# EAGLE design light (EAGLE 8.5.0)
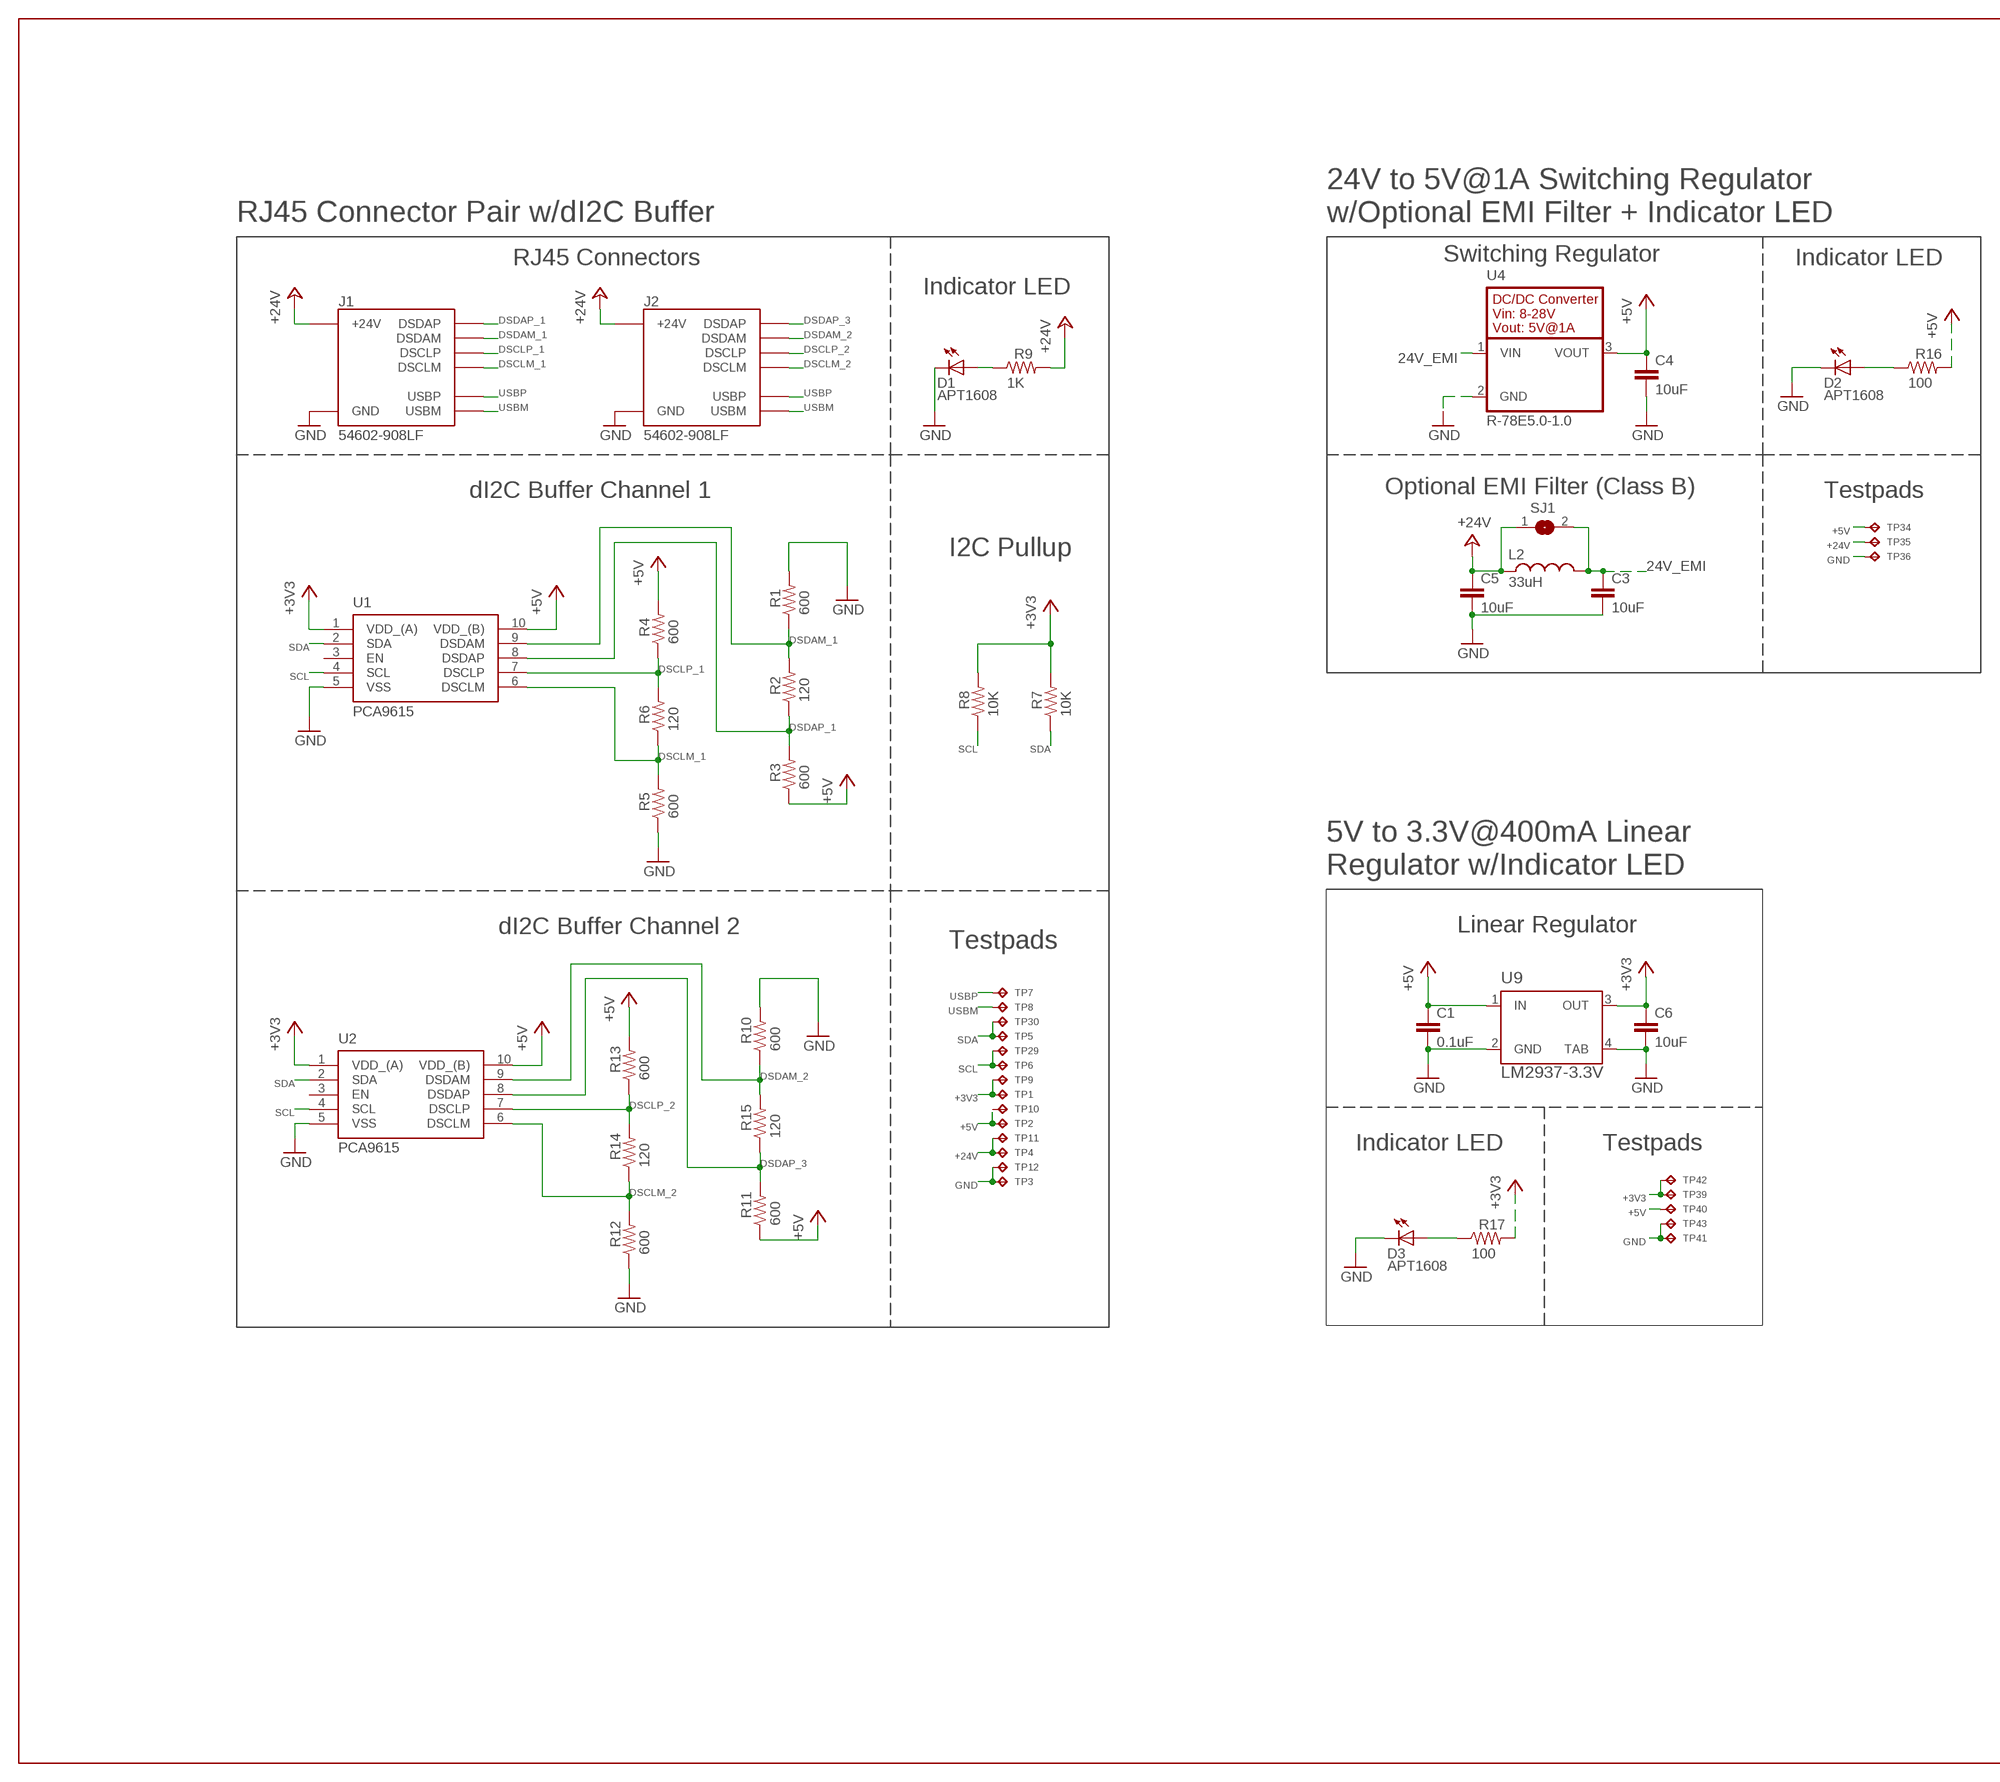
[diagram p0: schematic, sheet 1, part 1 of 2]
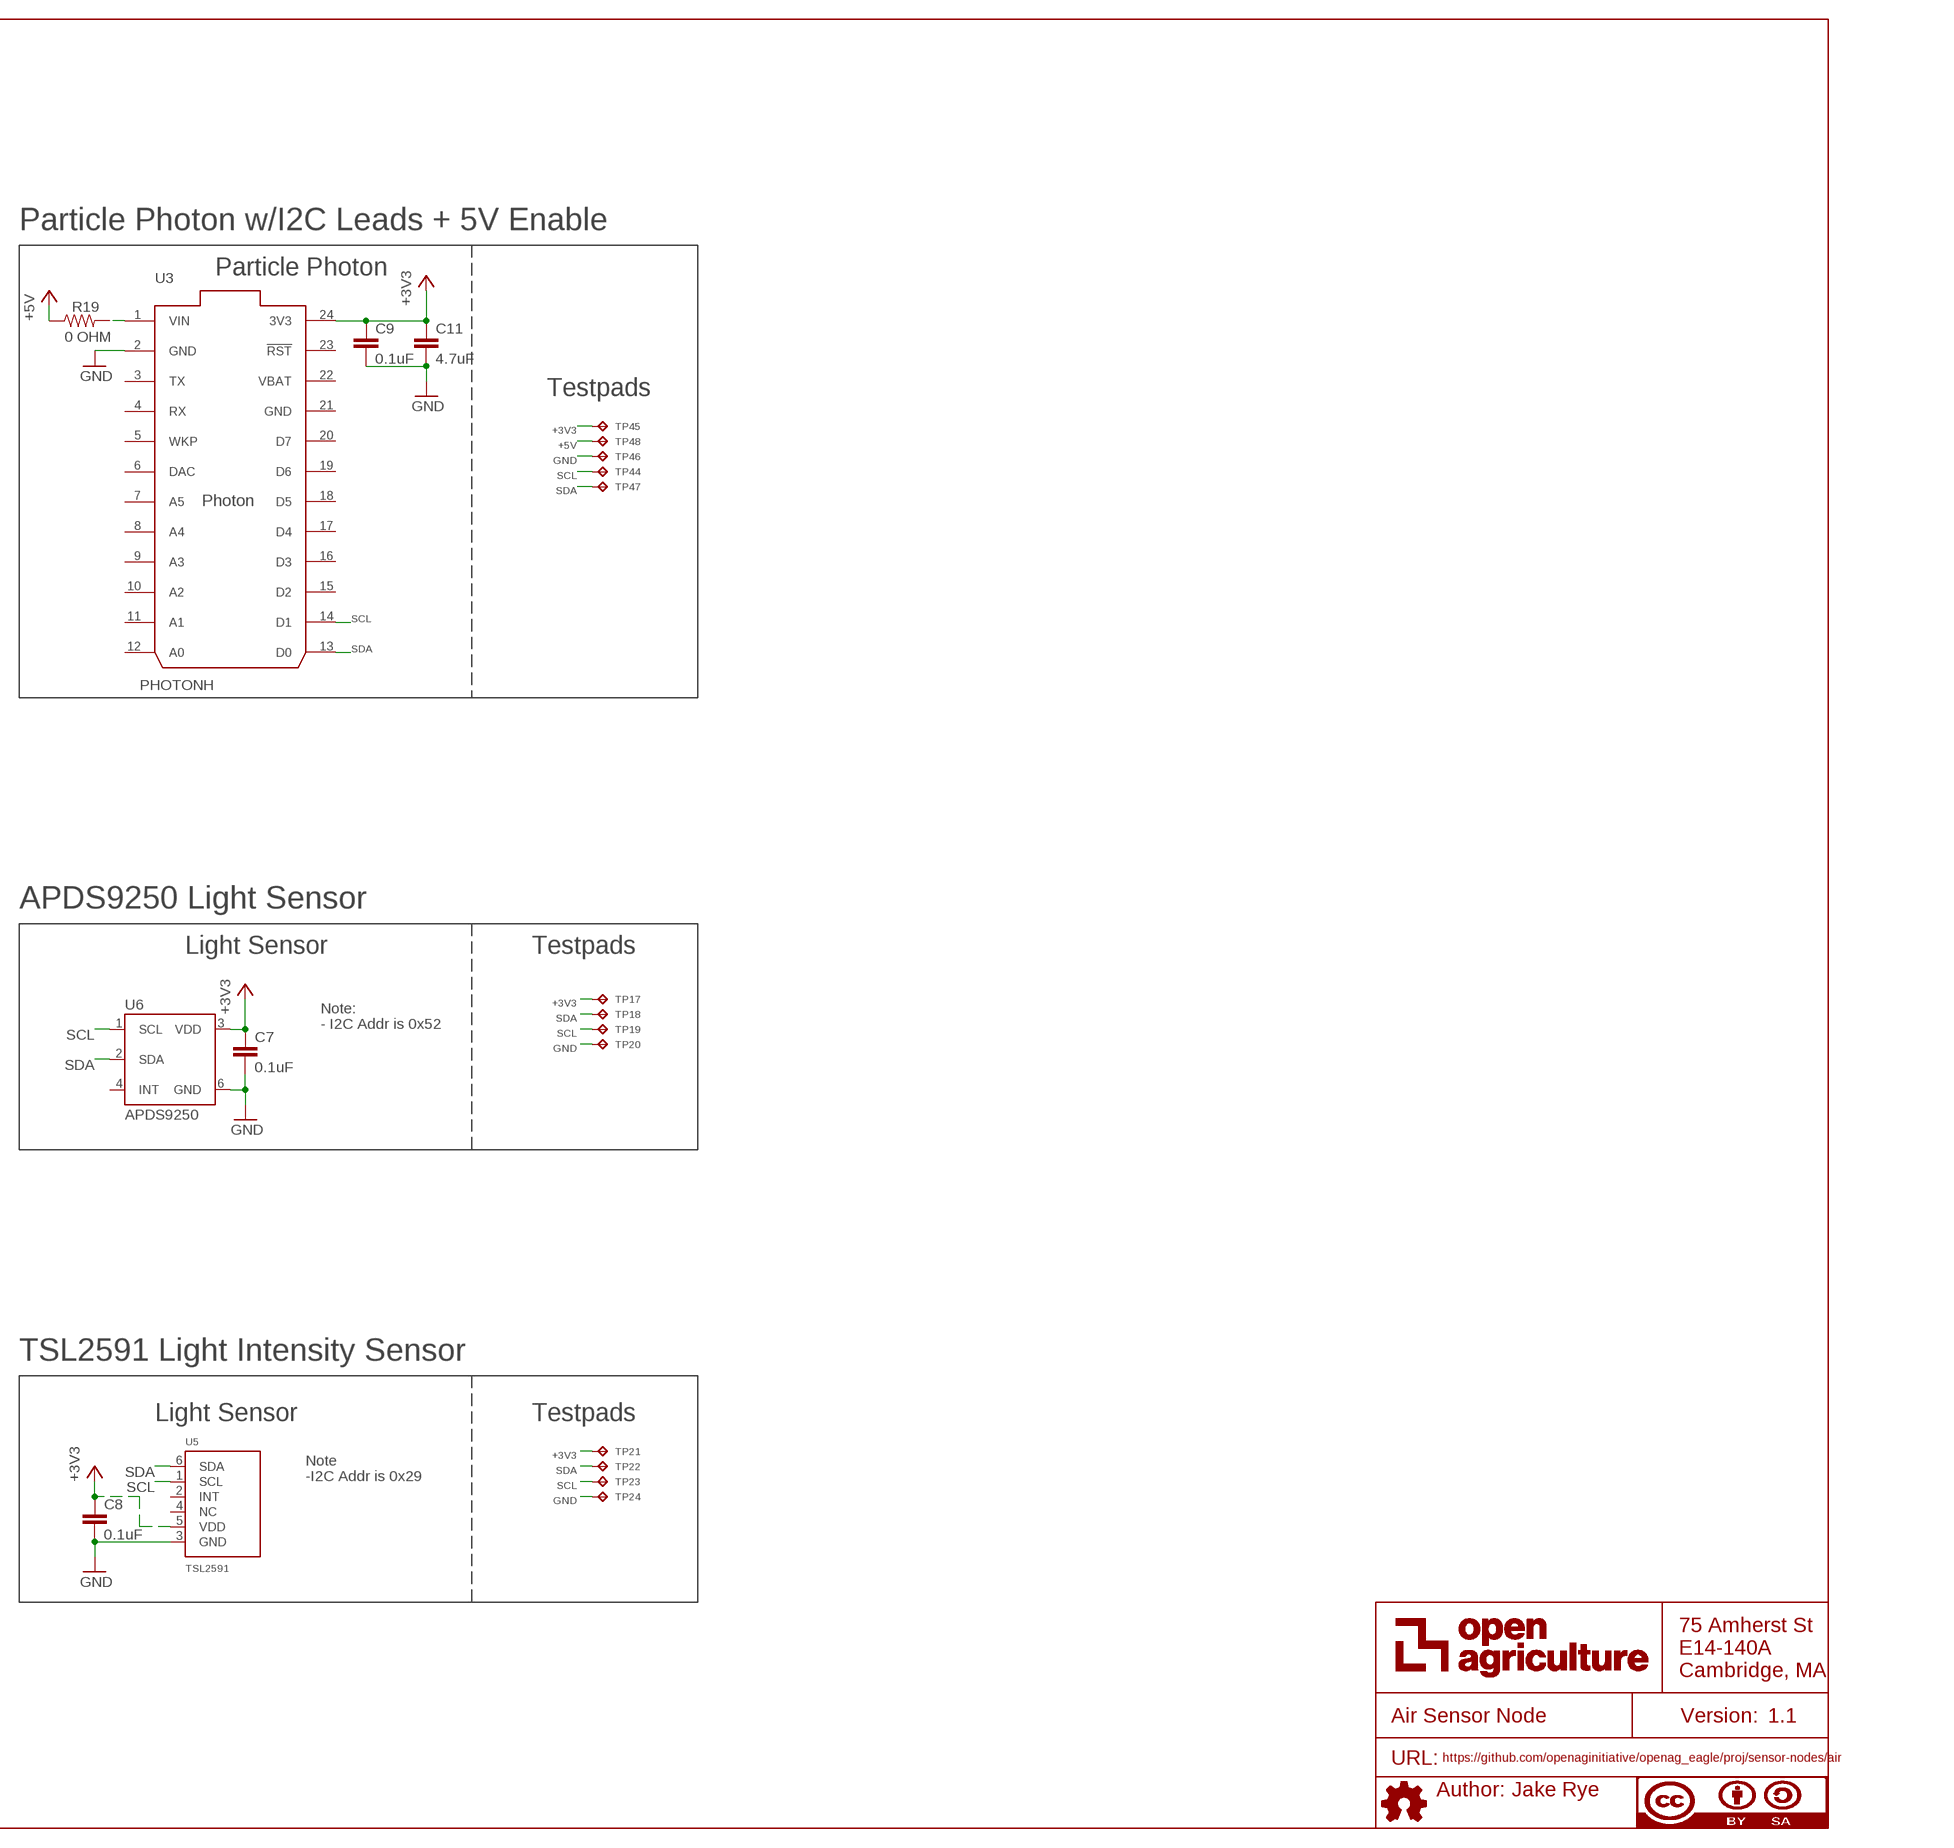
[diagram p1: schematic, sheet 1, part 2 of 2]

## Parts
C1  0.1uF  0.1UF-C0603C104K5RACTU  [C0603]
C3  10uF  10UF-GMK212BBJ106KG-T  [C0805]
C4  10uF  10UF-GMK212BBJ106KG-T  [C0805]
C5  10uF  10UF-GMK212BBJ106KG-T  [C0805]
C6  10uF  10UF-GMK212BBJ106KG-T  [C0805]
C7  0.1uF  0.1UF-C0603C104K5RACTU  [C0603]
C8  0.1uF  0.1UF-C0603C104K5RACTU  [C0603]
C9  0.1uF  0.1UF-C0603C104K5RACTU  [C0603]
C11  4.7uF  4.7UF-CL21A475KBQNNNE  [C0805]
D1  APT1608  APT1608CGCK  [CHIPLED_0603]
D2  APT1608  APT1608CGCK  [CHIPLED_0603]
D3  APT1608  APT1608CGCK  [CHIPLED_0603]
J1  54602-908LF  RJ45-DI2C-USB-54602-908LFPTH  [RJ45-DI2C-USB-54602-908LF]
J2  54602-908LF  RJ45-DI2C-USB-54602-908LFPTH  [RJ45-DI2C-USB-54602-908LF]
L2  33uH  33UH-29333C  [29333C]
R1  600  600OHM-RC0603FR-07604RL  [RC0603N]
R2  120  120OHM-RC0603FR-07120RL  [RC0603N]
R3  600  600OHM-RC0603FR-07604RL  [RC0603N]
R4  600  600OHM-RC0603FR-07604RL  [RC0603N]
R5  600  600OHM-RC0603FR-07604RL  [RC0603N]
R6  120  120OHM-RC0603FR-07120RL  [RC0603N]
R7  10K  10K-ERJ-3EKF1002V  [RC0603N]
R8  10K  10K-ERJ-3EKF1002V  [RC0603N]
R9  1K  1K-ERJ-PB3D1001V  [RC0603N]
R10  600  600OHM-RC0603FR-07604RL  [RC0603N]
R11  600  600OHM-RC0603FR-07604RL  [RC0603N]
R12  600  600OHM-RC0603FR-07604RL  [RC0603N]
R13  600  600OHM-RC0603FR-07604RL  [RC0603N]
R14  120  120OHM-RC0603FR-07120RL  [RC0603N]
R15  120  120OHM-RC0603FR-07120RL  [RC0603N]
R16  100  100OHM-RC0603JR-07100RL  [RC0603N]
R17  100  100OHM-RC0603JR-07100RL  [RC0603N]
R19  0 OHM  0OHM-RC0603JR-070RL  [RC0603N]
SJ1  EMI-BYPASS  [EMI-BYPASS]
TP1  TPTP04R  [TP04R]
TP2  TPTP04R  [TP04R]
TP3  TPTP04R  [TP04R]
TP4  TPTP04R  [TP04R]
TP5  TPTP04R  [TP04R]
TP6  TPTP04R  [TP04R]
TP7  TPTP04R  [TP04R]
TP8  TPTP04R  [TP04R]
TP9  TPTP04R  [TP04R]
TP10  TPTP04R  [TP04R]
TP11  TPTP04R  [TP04R]
TP12  TPTP04R  [TP04R]
TP17  TPTP04R  [TP04R]
TP18  TPTP04R  [TP04R]
TP19  TPTP04R  [TP04R]
TP20  TPTP04R  [TP04R]
TP21  TPTP04R  [TP04R]
TP22  TPTP04R  [TP04R]
TP23  TPTP04R  [TP04R]
TP24  TPTP04R  [TP04R]
TP29  TPTP04R  [TP04R]
TP30  TPTP04R  [TP04R]
TP34  TPTP06R  [TP06R]
TP35  TPTP06R  [TP06R]
TP36  TPTP06R  [TP06R]
TP39  TPTP04R  [TP04R]
TP40  TPTP04R  [TP04R]
TP41  TPTP04R  [TP04R]
TP42  TPTP04R  [TP04R]
TP43  TPTP04R  [TP04R]
TP44  TPTP04R  [TP04R]
TP45  TPTP04R  [TP04R]
TP46  TPTP04R  [TP04R]
TP47  TPTP04R  [TP04R]
TP48  TPTP04R  [TP04R]
U1  PCA9615  PCA9615DPJ  [SOP50P490X110-10N]
U2  PCA9615  PCA9615DPJ  [SOP50P490X110-10N]
U3  PHOTONH  PHOTONHPHOTONH  [PHOTON]
U4  R-78E5.0-1.0  [R-78E5.0-1.0]
U5  TSL2591  TSL25911FN  [DFN6_TAOS]
U6  APDS9250  APDS-9250  [APDS-9250]
U9  LM2937-3.3V  LM2937IMP-3.3/NOPB  [MP04A]
U$1  AUTHOR  [AUTHOR]
U$2  TITLE  [TITLE]

## Nets
24V_EMI: C3.1 L2.2 SJ1.2 U4.1(VIN)
+3V3: C6.1 C7.1 C8.1 C9.1 C11.1 R7.2 R8.2 R17.2 TP1.1(TP) TP9.1(TP) TP17.1(TP) TP21.1(TP) TP39.1(TP) TP42.1(TP) TP45.1(TP) U1.1(VDD_(A)) U2.1(VDD_(A)) U3.24(3V3) U5.5(VDD) U6.3(VDD) U9.3(OUT)
+5V: C1.1 C4.1 R3.1 R4.2 R11.1 R13.2 R16.2 R19.1 TP2.1(TP) TP10.1(TP) TP34.TP TP40.1(TP) TP48.1(TP) U1.10(VDD_(B)) U2.10(VDD_(B)) U4.3(VOUT) U9.1(IN)
+24V: C5.1 J1.24V(6)(+24V) J2.24V(6)(+24V) L2.1 R9.2 SJ1.1 TP4.1(TP) TP11.1(TP) TP35.TP
DSCLM_1: J1.DSCLM(5)(DSCLM) R5.2 R6.1 U1.6(DSCLM)
DSCLM_2: J2.DSCLM(5)(DSCLM) R12.2 R14.1 U2.6(DSCLM)
DSCLP_1: J1.DSCLP(4)(DSCLP) R4.1 R6.2 U1.7(DSCLP)
DSCLP_2: J2.DSCLP(4)(DSCLP) R13.1 R14.2 U2.7(DSCLP)
DSDAM_1: J1.DSDAM(2)(DSDAM) R1.1 R2.2 U1.9(DSDAM)
DSDAM_2: J2.DSDAM(2)(DSDAM) R10.1 R15.2 U2.9(DSDAM)
DSDAP_1: J1.DSDAP(1)(DSDAP) R2.1 R3.2 U1.8(DSDAP)
DSDAP_3: J2.DSDAP(1)(DSDAP) R11.2 R15.1 U2.8(DSDAP)
GND: C1.2 C3.2 C4.2 C5.2 C6.2 C7.2 C8.2 C9.2 C11.2 D1.C D2.C D3.C J1.GND(3)(GND) J2.GND(3)(GND) R1.2 R5.1 R10.2 R12.1 TP3.1(TP) TP12.1(TP) TP20.1(TP) TP24.1(TP) TP36.TP TP41.1(TP) TP43.1(TP) TP46.1(TP) U1.5(VSS) U2.5(VSS) U3.2(GND) U4.2(GND) U5.3(GND) U6.6(GND) U9.2(GND) U9.4(TAB)
N$4: D2.A R16.1
N$5: D3.A R17.1
N$6: D1.A R9.1
N$8: R19.2 U3.1(VIN)
SCL: R8.1 TP6.1(TP) TP19.1(TP) TP23.1(TP) TP29.1(TP) TP44.1(TP) U1.4(SCL) U2.4(SCL) U3.14(D1) U5.1(SCL) U6.1(SCL)
SDA: R7.1 TP5.1(TP) TP18.1(TP) TP22.1(TP) TP30.1(TP) TP47.1(TP) U1.2(SDA) U2.2(SDA) U3.13(D0) U5.6(SDA) U6.2(SDA)
USBM: J1.USBM(8)(USBM) J2.USBM(8)(USBM) TP8.1(TP)
USBP: J1.USBP(7)(USBP) J2.USBP(7)(USBP) TP7.1(TP)
Unconnected: U1.3(EN) U2.3(EN) U3.3(TX) U3.4(RX) U3.5(WKP) U3.6(DAC) U3.7(A5) U3.8(A4) U3.9(A3) U3.10(A2) U3.11(A1) U3.12(A0) U3.15(D2) U3.16(D3) U3.17(D4) U3.18(D5) U3.19(D6) U3.20(D7) U3.23(!RST) U5.2(INT) U5.4(NC) U6.4(INT)

## Notes on the sheet
- RJ45 Connector Pair w/dI2C Buffer
- 24V to 5V@1A Switching Regulator
  w/Optional EMI Filter + Indicator LED
- Particle Photon w/I2C Leads + 5V Enable
- RJ45 Connectors | Switching Regulator | Indicator LED | Particle Photon
- Indicator LED
- Testpads
- dI2C Buffer Channel 1 | Optional EMI Filter (Class B) | Testpads
- I2C Pullup
- 5V to 3.3V@400mA Linear 
  Regulator w/Indicator LED
- APDS9250 Light Sensor
- Light Sensor | Testpads
- dI2C Buffer Channel 2 | Linear Regulator
- Testpads
- Note:
  - I2C Addr is 0x52
- Indicator LED | Testpads
- TSL2591 Light Intensity Sensor
- Light Sensor | Testpads
- Note
  -I2C Addr is 0x29

## Power pins joined to a net without a drawn wire
GND: U3.21(GND)
VBAT: U3.22(VBAT)

## Library data of the parts
C1 C7-C9 = openag-capacitors:0.1UF-C0603C104K5RACTU: Kemet - C0603C104K5RACTU - CAP CER 0.1UF 50V X7R 0603 Description: 0.1µF ±10% 50V Ceramic Capacitor X7R 0603 (1608 Metric) Technical Specifications: Capacitance: 0.1µF Tolerance: ±10% Rated Voltage: 50V Temperature Coefficient: X7R Operating Temperature: -55°C ~ 125°C Package / Case: 0603 (1608 Metric) Datasheet(s): X7R Dielectric, 6.3-250 VDC Vendor(s): Digikey: 399-5089-1-ND; POPULATE: YES; VERIFIED: NO
C3-C6 = openag-capacitors:10UF-GMK212BBJ106KG-T: CAP CER 10UF 35V X5R 0805 Description: 10µF ±10% 35V Ceramic Capacitor X5R 0805 (2012 Metric) Technical Specifications: Capacitance: 10µF Tolerance: ±10% Rated Voltage: 35V Temperature Coefficient: X5R Operating Temperature: -55°C ~ 85°C Package / Case: 0805 (2012 Metric) Datasheet(s): GMK212BBJ106KG-T Spec Vendor(s): Digikey: 587-4893-1-ND; MANUFACTURER: Taiyo Yuden; MPN: GMK212BBJ106KG-T; VENDOR: Digikey; VLINK: https://www.digikey.com/product-detail/en/taiyo-yuden/GMK212BBJ106KG-T/587-4893-1-ND/6563736; VPN: 587-4893-1-ND
C11 = openag-capacitors:4.7UF-CL21A475KBQNNNE: CAP CER 4.7UF 50V X5R 0805 Description: 4.7µF ±10% 50V Ceramic Capacitor X5R 0805 (2012 Metric) Technical Specifications: Capacitance: 4.7uF Tolerance: ±10% Rated Voltage: 50V Temperature Coefficient: X5R Operating Temperature: -55°C ~ 85°C Package/Case: 0805 (2012 Metric) Datasheet(s): CL21A475KBQNNNE Characteristics Vendor(s): Digikey: 1276-1248-1-ND; MANUFACTURER: Samsung; MPN: CL21A475KBQNNNE; VENDOR: Digikey; VLINK: https://www.digikey.com/product-detail/en/samsung-electro-mechanics/CL21A475KBQNNNE/1276-1248-1-ND/3889334; VPN: 1276-1248-1-ND
D1-D3 = openag-diodes:APT1608CGCK: LED GREEN CLEAR 0603 SMD Description: Green 570nm LED Indication - Discrete 2.1V 0603 (1608 Metric) Technical Specifications: Color: Green Lens Color: Colorless Lens Transparency: Clear Millicandela Rating: 50mcd Lens Style/Size: Rectangle with Flat Top, 1.20mm x 0.80mm Voltage - Forward (Vf) (Typ): 2.1V Current - Test: 20mA Viewing Angle: 120° Mounting Type: Surface Mount Wavelength - Dominant: 570nm Wavelength - Peak: 574nm Package / Case: 0603 (1608 Metric) Supplier Device Package: Chip LED Size / Dimension: 1.60mm L x 0.80mm W Height (Max): 0.75mm Datasheet(s): APT1608CGCK Vendor(s): Digikey: 754-1116-1-ND; MANUFACTURER: Kingbright; MPN: APT1608CGCK; VENDOR: Digikey; VLINK: https://www.digikey.com/product-detail/en/kingbright/APT1608CGCK/754-1116-1-ND/1747833#; VPN: 754-1116-1-ND
J1 J2 = openag-connectors:RJ45-DI2C-USB-54602-908LF: CONN MOD JACK 8P8C R/A UNSHLD Description: Jack Modular Connector 8p8c (RJ45, Ethernet) 90° Angle (Right) Unshielded Cat3 Technical Specifications: Connector Type: Jack Number of Positions/Contacts: 8p8c (RJ45, Ethernet) Number of Ports: 1 Number of Rows: 1 Mounting Type: Through Hole Orientation: 90° Angle (Right) Termination: Solder Shielding: Unshielded Ratings: Cat3 Features: Board Lock LED Color: Does Not Contain LED Tab Direction: Down Contact Material: Copper Alloy Contact Finish: Gold Contact Finish Thickness: 15µin (0.38µm) Housing Material: Polyester, Glass Filled Operating Temperature: -40°C ~ 70°C Datasheet(s): 54601-x04(zzz)WPLF Drawing Vendor(s): Digikey: 609-1046-ND; MANUFACTURER: Amphenol FCI; MPN: 54602-908LF; VENDOR: Digikey; VLINK: https://www.digikey.com/product-detail/en/amphenol-fci/54602-908LF/609-1046-ND/1001360; VPN: 609-1046-ND
L2 = openag-inductors:33UH-29333C: FIXED IND 33UH 1A 120 MOHM SMD Description: 33µH Shielded Wirewound Inductor 1A 120 mOhm Max Nonstandard Technical Specifications: Type: Wirewound Inductance: 33µH Current Rating: 1A Shielding: Shielded DC Resistance (DCR): 120 mOhm Max Operating Temperature: -40°C ~ 85°C Frequency - Test: 10kHz Mounting Type: Surface Mount Package / Case: Nonstandard Size / Dimension: 0.283" L x 0.283" W (7.20mm x 7.20mm) Height - Seated (Max): 0.157" (4.00mm) Datasheet(s): 2900 Series Vendor(s): Digikey: 811-1138-1-ND; MANUFACTURER: Murata Power Solutions Inc.; MPN: 29333C; VENDOR: Digikey; VLINK: https://www.digikey.com/product-detail/en/murata-power-solutions-inc/29333C/811-1138-1-ND/1924860; VPN: 811-1138-1-ND
R1 R3-R5 R10-R13 = openag-resistors:600OHM-RC0603FR-07604RL: RES SMD 604 OHM 1% 1/10W 0603 Description: 604 Ohms ±1% 0.1W, 1/10W Chip Resistor 0603 (1608 Metric) Moisture Resistant Thick Film Technical Specifications: Resistance: 604 Ohms Tolerance: ±1% Power (Watts): 0.1W, 1/10W Composition: Thick Film Features: Moisture Resistant Temperature Coefficient: ±100ppm/°C Operating Temperature: -55°C ~ 155°C Package / Case: 0603 (1608 Metric) Supplier Device Package: 0603 Size / Dimension: 0.063" L x 0.032" W (1.60mm x 0.80mm) Height - Seated (Max): 0.022" (0.55mm) Number of Terminations: 2 Datasheet(s): RC Series, L Datasheet Chip Resistor Marking Vendor(s): Digikey: 311-604HRCT-ND; MANUFACTURER: Yageo; MPN: RC0603FR-07604RL; VENDOR: Digikey; VLINK: https://www.digikey.com/product-detail/en/yageo/RC0603FR-07604RL/311-604HRCT-ND/730276; VPN: 311-604HRCT-ND
R2 R6 R14 R15 = openag-resistors:120OHM-RC0603FR-07120RL: RES SMD 120 OHM 1% 1/10W 0603 Description: 120 Ohms ±1% 0.1W, 1/10W Chip Resistor 0603 (1608 Metric) Moisture Resistant Thick Film Technical Specifications: Resistance: 120 Ohms Tolerance: ±1% Power (Watts): 0.1W, 1/10W Composition: Thick Film Features: Moisture Resistant Temperature Coefficient: ±100ppm/°C Operating Temperature: -55°C ~ 155°C Package / Case: 0603 (1608 Metric) Supplier Device Package: 0603 Size / Dimension: 0.063" L x 0.032" W (1.60mm x 0.80mm) Height - Seated (Max): 0.022" (0.55mm) Number of Terminations: 2 Datasheet(s): RC Series, L Datasheet Chip Resistor Marking Vendor(s): Digikey: 311-120HRCT-ND; MANUFACTURER: Yageo; MPN: RC0603FR-07120RL; VENDOR: Digikey; VLINK: https://www.digikey.com/product-detail/en/yageo/RC0603FR-07120RL/311-120HRCT-ND/729867; VPN: 311-120HRCT-ND
R7 R8 = openag-resistors:10K-ERJ-3EKF1002V: RES SMD 10K OHM 1% 1/10W 0603 Description: 10 kOhms ±1% 0.1W, 1/10W Chip Resistor 0603 (1608 Metric) Automotive AEC-Q200 Thick Film Technical Specifications: Resistance: 10kOhms Tolerance: ±1% Power: 0.1W, 1/10W Operating Temperature: -55°C ~ 155°C Package/Case: 0603 (1608 Metric) Datasheet(s): ERJ-3EKF1002V View All Specifications Vendor(s): Digikey: P10.0KHCT-ND; MANUFACTURER: Panasonic; MPN: ERJ-3EKF1002V; VENDOR: Digikey; VLINK: https://www.digikey.com/product-detail/en/panasonic-electronic-components/ERJ-3EKF1002V/P10.0KHCT-ND/198102; VPN: P10.0KHCT-ND
R9 = openag-resistors:1K-ERJ-PB3D1001V: RES SMD 1K OHM 0.5% 1/5W 0603 Description: 1 kOhms ±0.5% 0.2W, 1/5W Chip Resistor 0603 (1608 Metric) Automotive AEC-Q200, Pulse Withstanding Thick Film Technical Specifications: Resistance: 1 kOhms Tolerance: ±0.5% Power: 0.2W, 1/5W Operating Temperature: -55°C ~ 155°C Package / Case: 0603 (1608 Metric) Datasheet(s): ERJ-PB3, PB6 Series, High Precision Datasheet Vendor(s): Digikey: P20283CT-ND; MANUFACTURER: Panasonic; MPN: P20283CT-ND; VENDOR: Digikey; VLINK: https://www.digikey.com/product-detail/en/panasonic-electronic-components/ERJ-PB3D1001V/P20283CT-ND/6214538; VPN: P20283CT-ND
R16 R17 = openag-resistors:100OHM-RC0603JR-07100RL: RES SMD 100 OHM 5% 1/10W 0603 Description: 100 Ohms ±5% 0.1W, 1/10W Chip Resistor 0603 (1608 Metric) Moisture Resistant Thick Film Technical Specifications: Resistance: 100 Ohms Tolerance: ±5% Power (Watts): 0.1W, 1/10W Composition: Thick Film Features: Moisture Resistant Temperature Coefficient: ±100ppm/°C Operating Temperature: -55°C ~ 155°C Package / Case: 0603 (1608 Metric) Supplier Device Package: 0603 Size / Dimension: 0.063" L x 0.032" W (1.60mm x 0.80mm) Height - Seated (Max): 0.022" (0.55mm) Number of Terminations: 2 Datasheet(s): Thick Film Chip Resistor Intro Chip Resistor Marking RC Series, L Datasheet Vendor(s): Digikey: 311-100GRCT-ND; MANUFACTURER: Yageo; MPN: RC0603JR-07100RL; VENDOR: Digikey; VLINK: https://www.digikey.com/product-detail/en/yageo/RC0603JR-07100RL/311-100GRCT-ND/729644; VPN: 311-100GRCT-ND
R19 = openag-resistors:0OHM-RC0603JR-070RL: RES SMD 0 OHM JUMPER 1/10W 0603 Description: 0 Ohms Jumper 0.1W, 1/10W Chip Resistor 0603 (1608 Metric) Moisture Resistant Thick Film Technical Specifications: Resistance: 0 Ohms Power: 0.1W, 1/10W Operating Temperature: -55°C ~ 155°C Package / Case: 0603 (1608 Metric) Datasheet(s): RC Series, L Datasheet Vendor(s): Digikey: 311-0.0GRCT-ND; MANUFACTURER: Yageo; MPN: RC0603JR-070RL; VENDOR: Digikey; VLINK: https://www.digikey.com/product-detail/en/yageo/RC0603JR-070RL/311-0.0GRCT-ND/729622; VPN: 311-0.0GRCT-ND
SJ1 = openag-connectors:EMI-BYPASS: EMI Bypass Solder Jumper; MPN: N/A
TP1-TP12 TP17-TP24 TP29 TP30 TP34-TP36 TP39-TP48 = openag-testpads:TP: Test pad; MPN: N/A
U1 U2 = openag-buffers:PCA9615DPJ: IC REDRIVER I2C 2CH 10TSSOP Description: Buffer, ReDriver 2 Channel 400kHz 10-TSSOP Technical Specifications: Type: Buffer, ReDriver Applications: I²C Input: 2-Wire Bus Output: 2-Wire Bus Data Rate (Max): 400kHz Number of Channels: 2 Capacitance - Input: 7pF Voltage - Supply: 2.3 V ~ 5.5 V Current - Supply: 16µA Operating Temperature: -40°C ~ 85°C Package / Case: 10-TFSOP, 10-MSOP (0.118", 3.00mm Width) Supplier Device Package: 10-TSSOP Base Part Number: PCA9615 Datasheet(s): PCA9615DP Vendor(s): Digikey: 568-11484-1-ND; MANUFACTURER: NXP USA Inc.; MPN: PCA9615DPJ; VENDOR: Digikey; VLINK: https://www.digikey.com/product-detail/en/nxp-usa-inc/PCA9615DPJ/568-11484-1-ND/4864508; VPN: 568-11484-1-ND
U3 = openag-microcontrollers:PHOTONH: Tiny Wi-Fi dev board w/cloud backend Description: The Photon is a $19 tiny Wi-Fi development kit for creating connected projects and products for the Internet of Things. It's easy to use, it's powerful, and it's connected to the cloud. Technical Specifications: Processor: STM32F205RGY6 120Mhz ARM Cortex M3 Wireless: 802.11b/g/n Wi-Fi Peripherals: Digital(x18), ADC(x8), DAC(x2), SPI(x2), I2S(x1), I2C(x1) SPI, CAN(1), USB(1), PWM(9) Memory: 1MB flash, 128KB RAM Cerfifications: FCC, CE and IC Operating Temperature: -20°C ~ 60°C Humidity Range: Non condensing, relative humidity: 95% Supply Input Voltage (VIN): 3.6V ~ 5.5V Supply Input Voltage (3V3): 3.0V ~ 3.6V Max Supply Output Current (VIN): 1A Max Supply Output Current (3V3): 100mA Average Operating Current (WiFi on, @VIN): up to 100mA Peak Operating Current (WiFi on, @VIN): up to 430mA I/O Max Source/Sink Current (Individual): 25mA I/O Max Source/Sinnk Current (Total): 120mA Datasheet(s): Photon Datasheet Vendor(s): Particle: PHOTONH; MANUFACTURER: Particle; MPN: PHOTONH; VENDOR: Particle; VLINK: https://store.particle.io/products/photon; VPN: PHOTONH
U4 = openag-regulators:R-78E5.0-1.0: DC/DC CONVERTER 5V 5W Description: Linear Regulator Replacement DC DC Converter 1 Output 5V 1A 8V - 28V Input Technical Specifications: Type: Linear Regulator Replacement Number of Outputs: 1 Voltage - Input (Min): 8V Voltage - Input (Max): 28V Voltage - Output 1: 5V Current - Output (Max): 1A Power (Watts): 5W Applications: ITE (Commercial) Features: SCP Operating Temperature: -40°C ~ 85°C Efficiency: 91% Mounting Type: Through Hole Package / Case: 3-SIP Module Size / Dimension: 0.46" L x 0.33" W x 0.41" H (11.6mm x 8.5mm x 10.4mm) Datasheet(s): R-78E-1.0 Series Datasheet Vendor(s): Digikey: 945-2201-ND; MANUFACTURER: Recom Power; MPN: R-78E5.0-1.0; VENDOR: Digikey; VLINK: https://www.digikey.com/product-detail/en/recom-power/R-78E5.0-1.0/945-2201-ND/4930585; VPN: 945-2201-ND
U5 = openag-sensors:TSL25911FN: ams - TSL25911FN - IC LIGHT TO DGTL CONV 6-DFN Description: Optical Sensor Ambient I²C 6-WFDFN Technical Specifications: Type: Ambient Output Type: I²C Voltage - Supply: 2.7 V ~ 3.6 V Operating Temperature: -30°C ~ 70°C Mounting Type: Surface Mount Package / Case: 6-WFDFN Supplier Device Package: 6-DFN (2x2.2) Datasheet(s): TSl2591 Datasheet Vendor(s): Digikey: TSL25911FNCT-ND; POPULATE: YES; VERIFIED: NO
U6 = openag-sensors:APDS-9250: DIGITAL RGB, IR AND ALS Description: Optical Sensor Ambient 550nm I²C 6-SMD Module Technical Specifications: Type: Ambient Wavelength: 550nm Proximity Detection: No Output Type: I²C Voltage - Supply: 1.7 V ~ 3.6 V Operating Temperature: -40°C ~ 85°C Mounting Type: Surface Mount Package / Case: 6-SMD Module Datasheet(s): APDS-9250 Vendor(s): Digikey: 516-3293-1-ND; MANUFACTURER: Broadcom Limited; MPN: APDS-9250; VENDOR: Digikey; VLINK: https://www.digikey.com/product-detail/en/broadcom-limited/APDS-9250/516-3293-1-ND/5761192; VPN: 516-3293-1-ND
U9 = openag-regulators:LM2937IMP-3.3/NOPB: IC REG LIN 3.3V 400MA SOT223-4 Description: Linear Voltage Regulator IC Positive Fixed 1 Output 3.3V 400mA SOT-223-4 Technical Specifications: Output Configuration: Positive Output Type: Fixed Number of Regulators: 1 Voltage - Input (Max): 26V Voltage - Output (Min/Fixed): 3.3V Voltage Dropout (Max): 1V @ 50mA Current - Output: 400mA Current - Quiescent (Iq): 2mA Current - Supply (Max): 1.25A Protection Features: Over Temperature, Reverse Polarity, Short Circuit Operating Temperature: -40°C ~ 85°C Mounting Type: Surface Mount Package / Case: TO-261-4, TO-261AA Supplier Device Package: SOT-223-4 Base Part Number: LM2937 Datasheet(s): LM2937-2.5, LM2937-3.3 Datasheet Vendor(s): Digikey: LM2937IMP-3.3/NOPBCT-ND; MANUFACTURER: Texas Instruments; MPN: LM2937IMP-3.3/NOPB; VENDOR: Digikey; VLINK: https://www.digikey.com/product-detail/en/texas-instruments/LM2937IMP-3.3-NOPB/LM2937IMP-3.3-NOPBCT-ND/270742#; VPN: LM2937IMP-3.3/NOPBCT-ND
U$1 = openag-frames:AUTHOR; AUTHOR: Jake Rye; MPN: N/A
U$2 = openag-frames:TITLE; MPN: N/A; TITLE: Air Sensor Node; URL: https://github.com/openaginitiative/openag_eagle/proj/sensor-nodes/air; VER: 1.1

## Board
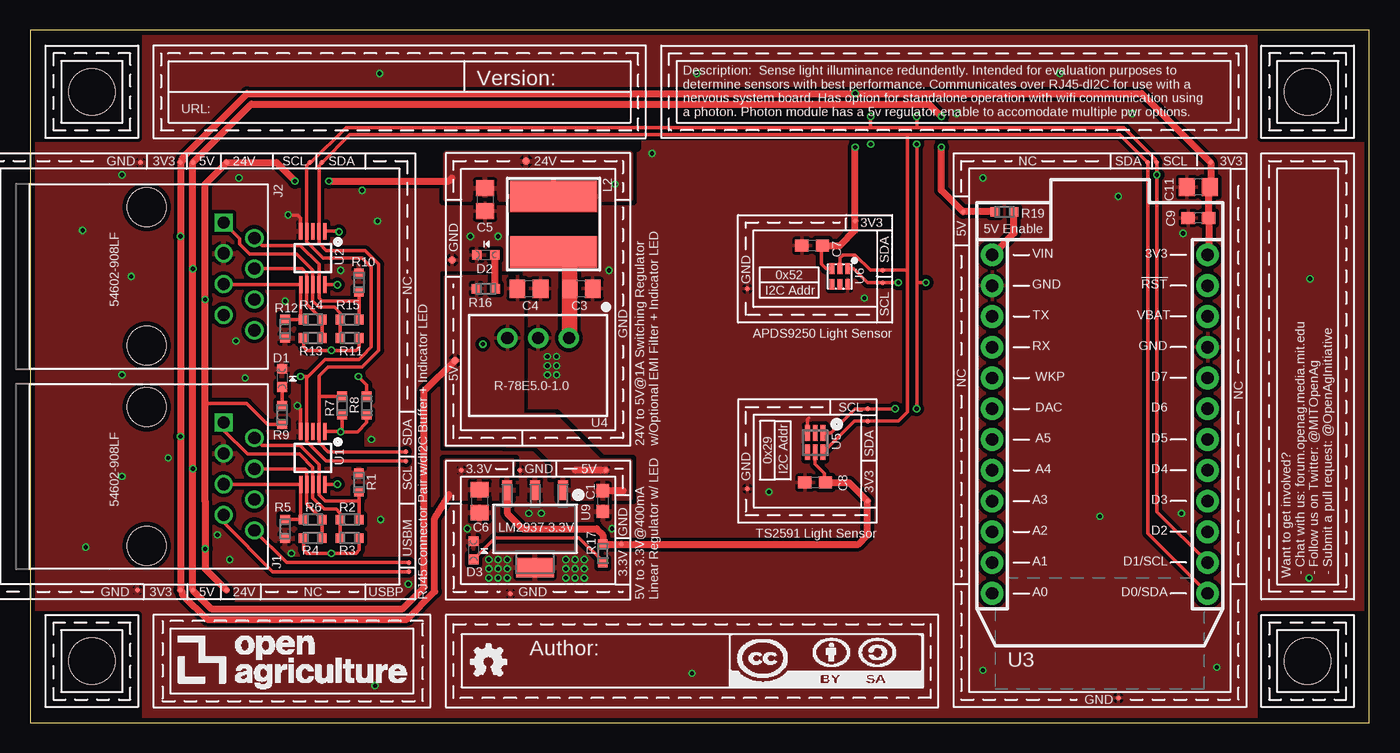
[diagram p2: board, top side]
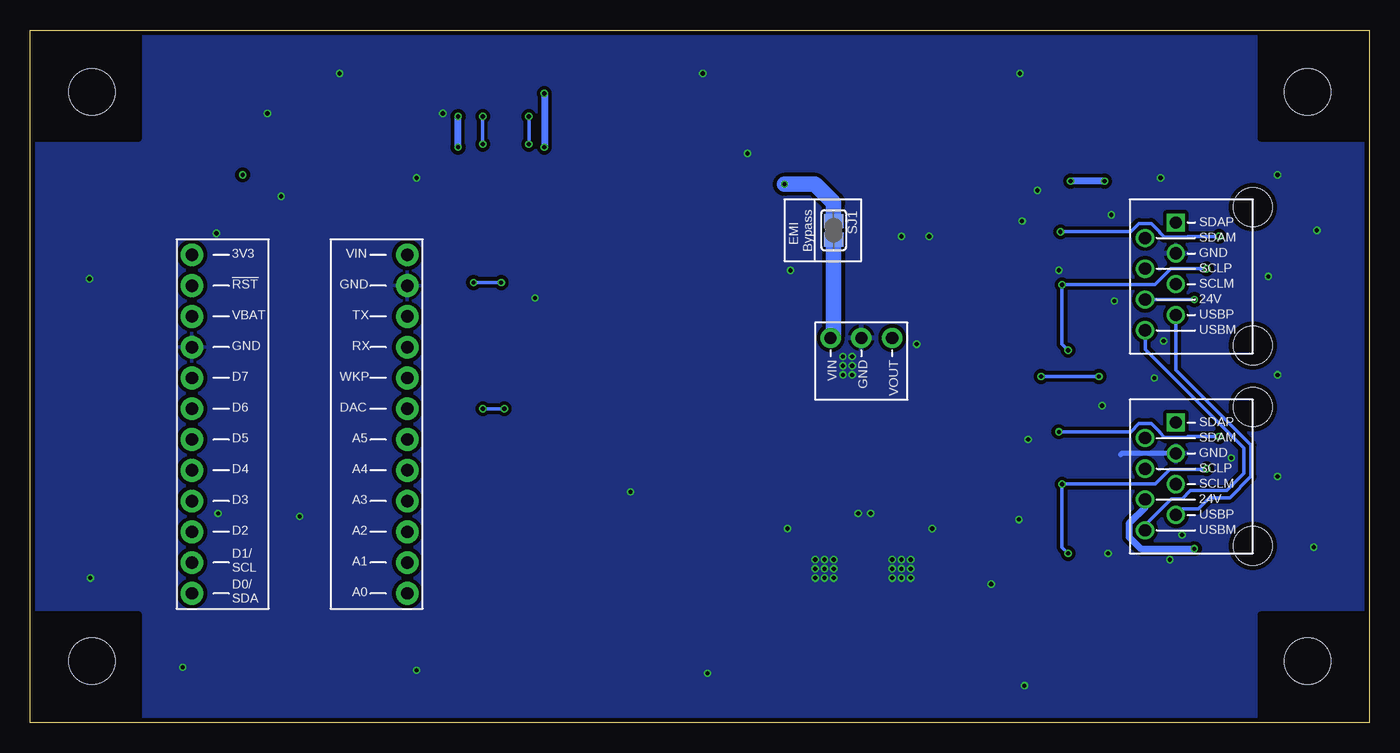
[diagram p3: board, bottom side, seen from below]

Size 110.49 x 57.15 mm. Coordinates in mm from the lower left corner, seen from the top.
Outline: 0,0 110.49,0 110.49,57.15 0,57.15 0,0
Copper layers (1*16): Top 0.035559375mm / dielectric 1.6mm / Bottom 0.035559375mm
Design rules "openag-router": minimum track width 6mil, minimum drill 10mil, track to track 12mil, track to pad 12mil, pad to pad 12mil, via to via 12mil, smd to smd 12mil, copper to edge 15mil, drill to drill 6mil, minimum pad ring 5mil, minimum via ring 5mil, stop-mask expansion 2.5mil, vias tented up to drill 20mil, thermal gap 10mil
tRestrict: 5 lines

### Footprints (pad centres in the part's own frame; a part is rotated, then mirrored left to right if it is on the bottom)
C0603 = smd 1.1 x 1: 1 -0.85,0; 2 0.85,0
C0805 = smd 1.3 x 1.5: 1 -0.95,0; 2 0.95,0
CHIPLED_0603 = smd 0.8 x 0.8: A 0,-0.75; C 0,0.75
RJ45-DI2C-USB-54602-908LF = drill 1: 24V(6) 1.905,8.89; DSCLM(5) 0.635,6.35; DSCLP(4) -0.635,8.89; DSDAM(2) -3.175,8.89; GND(3) -1.905,6.35; USBM(8) 4.445,8.89; USBP(7) 3.175,6.35 | drill 1 square: DSDAP(1) -4.445,6.35 | hole 3.2: -5.715,0; 5.715,0
29333C = smd 2.6 x 7.2: 1 -2.3,0; 2 2.3,0
RC0603N = smd 0.756 x 0.8: 1 -0.778,0; 2 0.778,0
EMI-BYPASS = smd 1.168 x 1.6: 1 -0.762,0.254; 2 0.762,0.254
TP04R = smd 0.4 x 0.4: 1 0,0
TP06R = smd 0.6 x 0.6: TP 0,0
SOP50P490X110-10N = smd 1.4 x 0.3: 1 -2.2,1; 2 -2.2,0.5; 3 -2.2,0; 4 -2.2,-0.5; 5 -2.2,-1; 6 2.2,-1; 7 2.2,-0.5; 8 2.2,0; 9 2.2,0.5; 10 2.2,1
PHOTON = drill 1.016 pad 1.88: 1 1.27,32.258; 2 1.27,29.718; 3 1.27,27.178; 4 1.27,24.638; 5 1.27,22.098; 6 1.27,19.558; 7 1.27,17.018; 8 1.27,14.478; 9 1.27,11.938; 10 1.27,9.398; 11 1.27,6.858; 12 1.27,4.318; 13 19.05,4.318; 14 19.05,6.858; 15 19.05,9.398; 16 19.05,11.938; 17 19.05,14.478; 18 19.05,17.018; 19 19.05,19.558; 20 19.05,22.098; 21 19.05,24.638; 22 19.05,27.178; 23 19.05,29.718; 24 19.05,32.258
R-78E5.0-1.0 = drill 1 pad 1.676: 1 -2.54,0; 2 0,0; 3 2.54,0
DFN6_TAOS = smd 1.3 x 0.4: 1 -0.8,0.65; 2 -0.8,0; 3 -0.8,-0.65; 4 0.8,-0.65; 5 0.8,0; 6 0.8,0.65
APDS-9250 = smd 0.4 x 0.9: 1 -0.65,-0.65; 2 0,-0.65; 3 0.65,-0.65; 4 0.65,0.65; 5 0,0.65; 6 -0.65,0.65
MP04A = smd 1.6 x 0.838: 1 -3.2,2.3; 2 -3.2,0; 3 -3.2,-2.3 | smd 1.6 x 3.099: 4 3.2,0
CORNER-150 = hole 3.81: 0,0

### Placement (x,y rotation side)
C1  47.24,18.29 270 top
C3  45.47,35.81 0 top
C4  41.15,35.81 0 top
C5  37.53,43.18 270 top
C6  37.08,18.29 270 top
C7  64.52,39.37 180 top
C8  64.77,19.81 180 top
C9  96.39,41.66 180 top
C11  96.39,44.2 180 top
D1  20.78,28.45 0 top
D2  37.59,38.61 90 top
D3  36.58,14.22 0 top
J1  9.6,20.32 270 top
J2  9.6,36.83 270 top
L2  43.18,41.15 270 top
R1  27.13,19.81 90 top
R2  26.37,16.76 0 top
R3  26.37,15.24 180 top
R4  23.32,15.24 180 top
R5  21.03,16 90 top
R6  23.32,16.76 0 top
R7  25.73,26.16 270 top
R8  27.76,26.16 270 top
R9  20.78,25.4 270 top
R10  27.13,36.32 90 top
R11  26.37,31.75 180 top
R12  21.03,32.51 90 top
R13  23.32,31.75 180 top
R14  23.32,33.27 0 top
R15  26.37,33.27 0 top
R16  37.59,35.81 180 top
R17  47.24,13.97 90 top
R19  80.39,42.16 0 top
SJ1  44.45,40.64 270 bottom
TP1  12.4,10.92 0 top
TP2  13.41,10.92 0 top
TP3  8.84,10.92 0 top
TP4  16.21,10.92 0 top
TP5  30.99,22.35 0 top
TP6  30.99,21.59 0 top
TP7  31.24,12.45 0 top
TP8  31.24,13.21 0 top
TP9  12.4,46.23 0 top
TP10  13.41,46.23 0 top
TP11  16.21,46.23 0 top
TP12  9.09,46.23 0 top
TP17  68.07,41.4 0 top
TP18  70.36,37.34 0 top
TP19  70.36,36.32 0 top
TP20  59.18,35.81 0 top
TP21  69.09,18.29 0 top
TP22  69.09,24.89 0 top
TP23  69.09,25.91 0 top
TP24  59.18,19.3 0 top
TP29  23.06,46.23 0 top
TP30  24.08,46.23 0 top
TP34  35.05,29.91 180 top
TP35  40.89,46.35 180 top
TP36  34.8,38.16 180 top
TP39  48.77,14.73 180 top
TP40  47.5,20.83 180 top
TP41  39.62,10.67 180 top
TP42  35.56,20.83 180 top
TP43  40.39,20.83 180 top
TP44  92.96,46.23 270 top
TP45  97.41,46.23 270 top
TP46  89.79,2.03 270 top
TP47  92.2,46.23 270 top
TP48  76.96,42.16 90 top
U1  23.32,21.84 270 top
U2  23.32,38.35 270 top
U3  78.11,6.35 0 top
U4  41.91,31.75 180 top
U5  64.77,23.11 270 top
U6  66.8,36.83 180 top
U9  41.66,16 270 top
U$1  34.29,1.27 0 top
U$2  10.16,48.26 0 top
U$5  [LOGO-900X300]  10.16,1.27 0 top
U$6  [CORNER-150]  5.08,5.08 0 top
U$7  [CORNER-150]  105.41,5.08 90 top
U$8  [CORNER-150]  5.08,52.07 270 top
U$9  [CORNER-150]  105.41,52.07 180 top

### Tracks (layer width: path | path; a pad name or v marks a point on that pad's centre or on a via)
24V_EMI
  Top 1.27: U4.1 44.52,31.82 C3.1 44.52,37.51 arc90 L2.2
  Bottom 1.27: SJ1.2 44.2,32 U4.1
+3V3  (via drill 0.35)
  Top 0.305: v25.6,24 25.73,24.13 R7.2 | v25.48,40.51 25.43,40.55 U2.1 | v25.6,24 27,24 27.76,24.77 R8.2 | U1.1 25.56,24.04 v25.6,24 | U6.3 65.64,37.48 65.28,37.85 65.28,39.28 C7.1 | C8.1 65.53,19.9 65.53,20.57 64.77,21.34 U5.5 | 68.07,51.92 v68.07,51.94
  Top 0.559: U9.3 39.36,17.29 40.64,16 46.74,16 47.24,15.49 R17.2 47.26,14.73 TP39.1 68.33,14.73 69.09,15.49 TP21.1 67.56,19.81 C8.1 | 34.54,18.8 33.38,16.87 33.38,10.82 31.09,8.53 14.58,8.53 12.55,10.56 12.55,10.77 TP1.1 v12.39,23.62 v12.39,40.13 TP9.1 12.55,46.38 12.55,46.59 17.88,51.92 68.07,51.92 91.72,51.92 TP45.1 97.41,44.26 C11.1 97.24,44.35 C9.1 | 97.34,41.76 C9.1 | C9.1 97.24,38.7 U3.24 | C7.1 66.8,39.37 68.07,40.64 TP17.1 v68.07,47.5
  Bottom 0.305: v25.6,24 19.69,24 18.99,24.7 17.99,24.7 17.28,24 17.28,23.95 16.89,23.56 15.01,23.56 14.95,23.62 v12.39,23.62 | v12.39,40.13 14.95,40.13 15.01,40.07 16.89,40.07 17.28,40.46 17.28,40.51 17.99,41.21 18.99,41.21 19.69,40.51 v25.48,40.51
  Bottom 0.559: v68.07,51.94 v68.07,47.5
  pour Top (isolate 0.305): 34.29,21.59 34.29,18.54 39.88,18.54 39.88,21.59
+5V  (via drill 0.35)
  Top 0.305: v25.35,36.14 25.34,36.15 U2.10 | R13.2 22.54,31 22.81,30.73 v24.84,30.73 26.87,30.73 27.14,31 R11.1 | v25.35,19.68 25.31,19.64 U1.10 | R4.2 22.54,14.24 22.81,13.97 v24.84,13.97 26.87,13.97 27.14,14.24 R3.1
  Top 0.559: 48.93,19.14 C1.1 | TP40.1 44.96,20.83 | TP34.TP 32.51,27.37 32.51,11.18 30.73,9.4 14.94,9.4 TP2.1 v13.41,20.95 v13.41,37.47 TP10.1 18.24,51.05 74.17,51.05 v75.18,50.04 | R19.1 TP48.1 75.18,43.94 v75.18,47.5
  Bottom 0.305: v24.84,30.73 25.35,31.24 v25.35,36.14 17.71,36.14 16.39,37.47 v13.41,37.47 | v13.41,20.95 13.47,20.89 16.45,20.89 17.66,19.68 v25.35,19.68 25.35,14.48 v24.84,13.97
  Bottom 0.559: v75.18,47.5 v75.18,50.04
  pour Top (isolate 0.305): 34.29,22.86 34.29,36.83 40.64,36.83 40.64,22.86
  pour Top (isolate 0.305): 49.53,21.59 43.69,21.59 43.69,18.54 49.53,18.54
  pour Top (isolate 0.406): 43.18,20.32 43.18,21.59 41.91,22.86 39.37,22.86 39.37,25.4 43.18,25.4 46.99,21.59 46.99,20.32
+24V  (via drill 0.35)
  Top 0.305: 14.55,18.41 14.43,18.29 | 14.43,26.35 17.86,26.35 19.59,24.62 R9.2
  Top 0.559: TP4.1 14.43,12.7 v14.43,14.35 14.43,18.29 14.43,26.35 v14.43,34.92 14.43,44.45 TP11.1 20.32,46.23 v21.84,44.7 | v24.64,44.7 34.54,44.7 34.8,44.96
  Bottom 0.305: J2.24V(6) v14.43,34.92
  Bottom 0.559: v14.43,14.35 18.86,14.35 19.82,15.32 19.82,16.43 18.49,17.76 J1.24V(6) | v21.84,44.7 v24.64,44.7
  Bottom 1.27: SJ1.1 44.2,42.93 45.72,44.45 v48.26,44.45
  pour Top (isolate 0.406): 34.29,43.18 34.29,46.99 49.53,46.99 49.53,43.18
DSCLM_1
  Top 0.305: 22.3,16.76 R6.1 22.44,16.8 22.32,16.92 U1.6 15.99,19.64 J1.DSCLM(5) | 22.3,16.76 21.05,16.76 R5.2 | 22.32,16.78 22.3,16.76
DSCLM_2
  Top 0.305: R12.2 21.05,33.27 R14.1 22.32,33.5 U2.6 15.99,36.15 J2.DSCLM(5)
DSCLP_1
  Top 0.305: R4.1 R6.2 22.82,18.04 U1.7 22.82,20.82 22.68,20.95 J1.DSCLP(4)
DSCLP_2
  Top 0.305: R13.1 R14.2 22.82,34.54 U2.7 22.82,37.08 22.43,37.47 J2.DSCLP(4)
DSDAM_1
  Top 0.305: R2.2 27.14,18.29 | 27.14,18.29 27.14,18.76 R1.1 | 27.14,18.29 24.33,18.29 23.82,18.8 U1.9 23.82,21.33 22.29,22.86 19.13,22.86 J1.DSDAM(2)
DSDAM_2
  Top 0.305: R10.1 27.13,34.8 | 27.13,34.8 24.08,34.8 23.82,35.06 U2.9 23.82,37.84 | 27.13,34.8 27.13,33.29 R15.2 | 23.82,37.84 23.82,37.85 | 23.82,37.84 22.29,39.37 19.13,39.37 J2.DSDAM(2)
DSDAP_1
  Top 0.305: R2.1 R3.2 | 25.52,16.76 R2.1 | R2.1 25.59,17.29 25.25,17.62 24.24,17.62 23.32,18.54 U1.8 23.32,21.08 22.24,22.16 17.92,22.16 15.95,24.13 J1.DSDAP(1)
DSDAP_3
  Top 0.305: R11.2 R15.1 25.59,33.8 25.09,34.29 23.82,34.29 23.32,34.8 U2.8 23.32,37.34 21.98,38.67 18.12,38.67 17.28,39.51 17.28,39.94 J2.DSDAP(1)
GND  (via drill 0.35)
  Top 0.305: U1.5 22.32,25.38 | 22.32,25.38 22.3,25.4 | 22.32,25.38 22.32,25.89 v22.05,26.16 | U2.5 22.32,41.64 22.05,41.91 v21.29,41.91 | U5.3 64.12,25 64.26,25.15
  Bottom 0.406: J1.GND(3) 20.4,22.23 20.52,22.1
  other vias: 28.45,3.05 37.34,31.24 38.61,40.13 47.75,37.34 42.67,30.23 42.67,29.46 43.43,29.46 43.43,30.23 42.67,28.7 43.43,28.7 36.32,40.13 7.57,20.32 28.91,16.76 7.57,28.7 8.33,36.83 17.73,28.45 7.57,45.21 25.6,37.34 21.54,13.97 27.38,43.94 28.65,41.4 28.14,23.37 15.44,15.49 16.97,31.5 11.38,21.84 16.46,13.46 21.03,34.8 17.22,44.96 44.2,12.7 44.2,13.46 44.96,12.7 44.96,13.46 45.72,13.46 45.72,12.7 44.2,11.94 45.72,11.94 44.96,11.94 39.37,13.46 38.61,13.46 37.85,13.46 39.37,12.7 39.37,11.94 38.61,12.7 38.61,11.94 37.85,11.94 37.85,12.7 42.16,17.27 36.07,16 41.15,17.27 48.01,16 95.12,40.39 88.27,17.02 51.31,46.99 76.45,50.29 90.93,50.29 95,17.27 89.79,43.43 97.92,4.57 78.61,4.32 31.19,11.43 54.61,4.06 4.57,14.48 4.32,40.64 78.61,44.96 105.6,36.64 105.54,11.94 54.99,53.59 28.83,53.59 84.96,53.59 68.83,35.05 60.96,19.05
  pour Top (isolate 0.305, rank 3): 0,0 110.49,0 110.49,57.15 0,57.15
  pour Bottom (isolate 0.305, rank 3): 0,0 110.49,0 110.49,57.15 0,57.15
  pour Top (isolate 0.305, rank 2): 34.29,22.86 34.29,46.99 49.53,46.99 49.53,22.86
  pour Bottom (isolate 0.406, rank 2): 49.53,22.86 49.53,46.99 34.29,46.99 34.29,22.86
  pour Top (isolate 0.305): -3.81,10.16 31.75,10.16 31.75,46.99 -3.81,46.99
  pour Bottom (isolate 0.406): 31.75,10.16 31.75,46.99 -3.81,46.99 -3.81,10.16
  pour Top (isolate 0.406, rank 3): 49.53,10.16 49.53,21.59 34.29,21.59 34.29,10.16
  pour Bottom (isolate 0.406): 49.53,10.16 34.29,10.16 34.29,21.59 49.53,21.59
  pour Top (isolate 0.305): 76.2,46.99 76.2,1.27 100.33,1.27 100.33,46.99
  pour Bottom (isolate 0.305): 76.2,46.99 100.33,46.99 100.33,1.27 76.2,1.27
  pour Top (isolate 0.305): 71.12,41.91 71.12,33.02 58.42,33.02 58.42,41.91
  pour Top (isolate 0.305): 58.42,26.67 58.42,16.51 69.85,16.51 69.85,26.67
  pour Bottom (isolate 0.406): 58.42,16.51 69.85,16.51 69.85,26.67 58.42,26.67
N$4
  Top 0.559: R16.1 38.37,38.58 D2.A
N$5
  Top 0.305: D3.A 38.37,15.27 45.3,15.27 47.24,13.32 R17.1
N$6
  Top 0.305: R9.1 D1.A
N$8
  Top 0.559: 79.5,38.73 U3.1 81.17,40.4 R19.2
SCL  (via drill 0.35)
  Top 0.305: 27.38,30.23 27.13,29.97 24.34,29.97 22.94,28.58 | 22.94,28.58 22.31,28.58 v22.3,28.57 | v27.06,28.57 27.76,27.88 R8.1 | 27.38,30.23 | 27.38,30.23 28.14,30.99 28.14,37.59 27.38,38.35 24.18,38.35 22.82,39.72 U2.4 22.82,45.98 TP29.1 23.15,46.23 26.05,49.12 69.34,49.12 | 22.94,28.58 22.82,28.45 U1.4 22.82,23.21 24.43,21.59 TP6.1 | U3.14 92.96,17.4 v92.96,45.22 TP44.1 92.86,46.33 92.86,46.5 90.24,49.12 73.15,49.12 | 69.34,49.12 73.15,49.12 | v69.34,50.04 69.34,49.12 | v73.15,50.04 73.15,49.12 | U6.1 67.93,37.48 69.09,36.32 TP19.1 v71.63,36.32 | U5.1 66.08,23.91 68.07,25.91 TP23.1 v71.37,25.91 | v73.15,47.75 73.15,36.32 | 73.15,36.32 v73.15,25.91 | v73.91,36.32 73.15,36.32
  Bottom 0.305: v22.3,28.57 v27.06,28.57 | v69.34,47.75 v69.34,50.04 | v73.15,47.75 v73.15,50.04 | v71.37,25.91 v73.15,25.91 | v71.63,36.32 v73.91,36.32
SDA
  Top 0.305: 23.82,26.92 23.82,28.59 24.59,29.36 27.38,29.36 28.75,30.73 28.75,37.84 27.63,38.96 24.43,38.96 23.82,39.58 U2.2 23.82,45.97 TP30.1 26.36,48.51 72.39,48.51 | R7.1 23.83,26.94 23.82,26.92 | TP5.1 24.59,22.35 23.82,23.12 U1.2 23.82,26.92 | U3.13 92.2,15.62 TP47.1 89.92,48.51 72.39,48.51 | U6.2 66.8,38.35 67.06,38.61 68.07,38.61 69.34,37.34 TP18.1 72.39,37.34 | U5.6 68,24.89 TP22.1 71.63,24.89 72.39,25.65 72.39,37.34 | 72.39,37.34 72.39,48.51
USBM
  Top 0.305: TP8.1 21.16,13.21 J1.USBM(8)
  Bottom 0.305: J2.USBM(8) 18.49,30.79 10.37,22.67 10.37,20.57 11.76,19.17 14.74,19.17 15.44,18.48 16.33,18.48 18.49,16.31 J1.USBM(8)
USBP
  Top 0.305: TP7.1 20.02,12.45 15.95,16.51 J1.USBP(7)
  Bottom 0.305: J1.USBP(7) 15.44,17.66 14.11,17.66 13.2,18.57 11.51,18.57 9.76,20.32 9.76,22.92 15.95,29.11 J2.USBP(7)

### Text on the board
tPlace: Description: Sense light illuminance redundently. Intended for evaluation purposes to / determine sensors with best performance. Communicates over RJ45-dI2C for use with a / nervous system board. Has option for standalone operation with wifi communication using / a photon. Photon module has a 5v regulator enable to accomodate multiple pwr options. | SCL | 24V | SDA | GND | 3V3 | 5V | 24V | SDA | NC | SCL | 3V3 | 3V3 | 5V Enable | SDA | 5V | GND | GND | 0x52 | I2C Addr | SCL | NC | APDS9250 Light Sensor | GND | NC | 5V | NC | EDGE | SCL | I2C Addr | 0x29 | SDA | SDA | 24V to 5V@1A Switching Regulator / w/Optional EMI Filter + Indicator LED | GND | SCL | 3.3V | GND | 5V | 3V3 | GND | TS2591 Light Sensor | USBM | 3.3V | Want to get involved? / - Chat with us: forum.openag.media.mit.edu / - Follow us on Twitter: @MITOpenAg / - Submit a pull request: @OpenAgInitiative | GND | 3V3 | GND | 5V | 24V | NC | USBP | RJ45 Connector Pair w/dI2C Buffer + Indicator LED | 5V to 3.3V@400mA / Linear Regulator w/ LED | GND